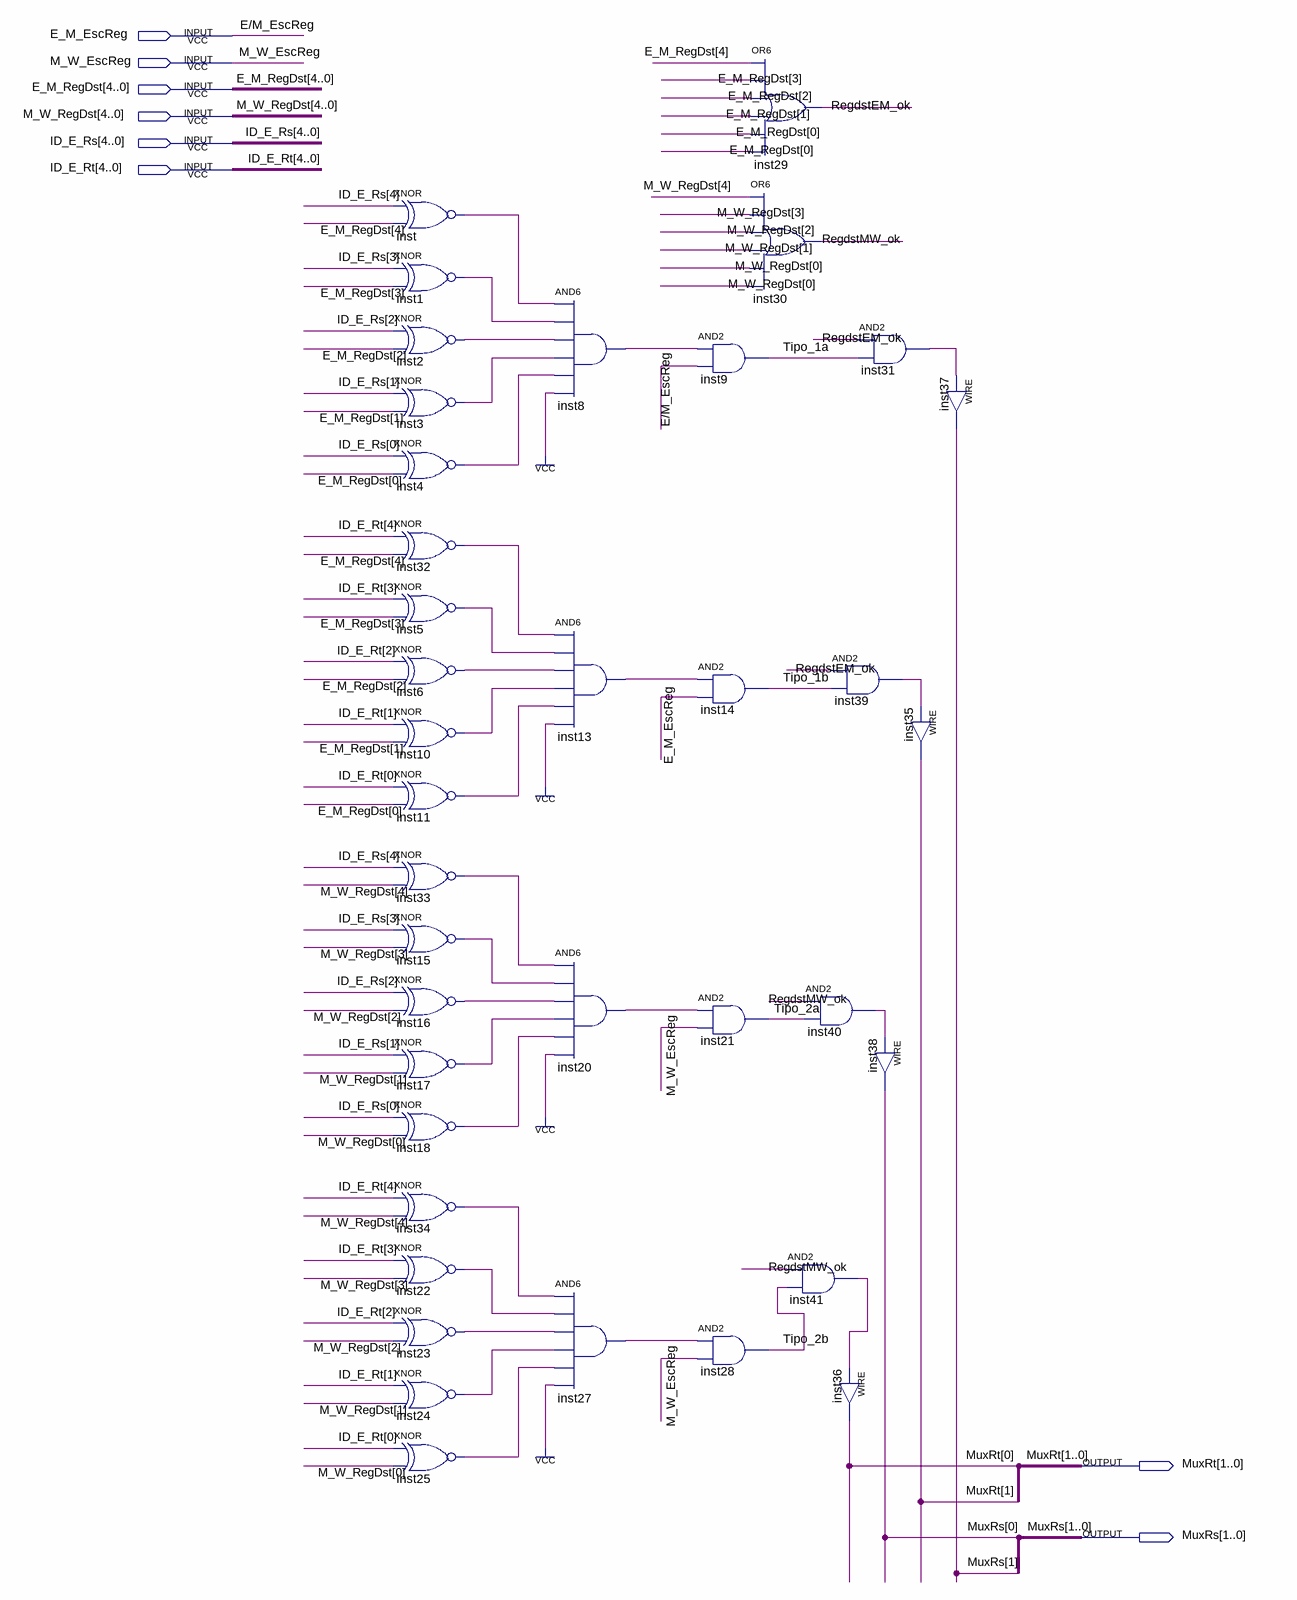
[diagram p0: schematic sheet]
// Quartus schematic Unidade_Forwarding.bdf as structural Verilog: 38 symbols, 8 pins
module Unidade_Forwarding (
  input  E_M_EscReg,
  input  M_W_EscReg,
  input  [4:0] E_M_RegDst,
  input  [4:0] M_W_RegDst,
  input  [4:0] ID_E_Rs,
  input  [4:0] ID_E_Rt,
  output [1:0] MuxRt,
  output [1:0] MuxRs
);

  wire inst1_out, inst2_out, inst3_out, inst4_out, inst5_out, inst6_out, inst8_out, inst10_out, inst11_out,
       inst13_out, inst15_out, inst16_out, inst17_out, inst18_out, inst20_out, inst22_out, inst23_out,
       inst24_out, inst25_out, inst27_out, inst31_out, inst32_out, inst33_out, inst34_out, inst39_out,
       inst40_out, inst41_out, inst_out, RegdstEM_ok, RegdstMW_ok, Tipo_1a, Tipo_1b, Tipo_2a, Tipo_2b;

  xnor inst (inst_out, ID_E_Rs[4], E_M_RegDst[4]);
  xnor inst1 (inst1_out, ID_E_Rs[3], E_M_RegDst[3]);
  xnor inst2 (inst2_out, ID_E_Rs[2], E_M_RegDst[2]);
  xnor inst3 (inst3_out, ID_E_Rs[1], E_M_RegDst[1]);
  xnor inst4 (inst4_out, ID_E_Rs[0], E_M_RegDst[0]);
  xnor inst32 (inst32_out, ID_E_Rt[4], E_M_RegDst[4]);
  xnor inst5 (inst5_out, ID_E_Rt[3], E_M_RegDst[3]);
  xnor inst6 (inst6_out, ID_E_Rt[2], E_M_RegDst[2]);
  xnor inst10 (inst10_out, ID_E_Rt[1], E_M_RegDst[1]);
  xnor inst11 (inst11_out, ID_E_Rt[0], E_M_RegDst[0]);
  xnor inst33 (inst33_out, ID_E_Rs[4], M_W_RegDst[4]);
  xnor inst15 (inst15_out, ID_E_Rs[3], M_W_RegDst[3]);
  xnor inst16 (inst16_out, ID_E_Rs[2], M_W_RegDst[2]);
  xnor inst17 (inst17_out, ID_E_Rs[1], M_W_RegDst[1]);
  xnor inst18 (inst18_out, ID_E_Rs[0], M_W_RegDst[0]);
  xnor inst34 (inst34_out, ID_E_Rt[4], M_W_RegDst[4]);
  xnor inst22 (inst22_out, ID_E_Rt[3], M_W_RegDst[3]);
  xnor inst23 (inst23_out, ID_E_Rt[2], M_W_RegDst[2]);
  xnor inst24 (inst24_out, ID_E_Rt[1], M_W_RegDst[1]);
  xnor inst25 (inst25_out, ID_E_Rt[0], M_W_RegDst[0]);
  and inst8 (inst8_out, inst_out, inst1_out, inst2_out, inst3_out, inst4_out, 1'b1);
  and inst13 (inst13_out, inst32_out, inst5_out, inst6_out, inst10_out, inst11_out, 1'b1);
  and inst20 (inst20_out, inst33_out, inst15_out, inst16_out, inst17_out, inst18_out, 1'b1);
  and inst27 (inst27_out, inst34_out, inst22_out, inst23_out, inst24_out, inst25_out, 1'b1);
  and inst9 (Tipo_1a, inst8_out, E_M_EscReg);
  and inst14 (Tipo_1b, inst13_out, E_M_EscReg);
  and inst21 (Tipo_2a, inst20_out, M_W_EscReg);
  and inst28 (Tipo_2b, inst27_out, M_W_EscReg);
  or inst29 (RegdstEM_ok, E_M_RegDst[4], E_M_RegDst[3], E_M_RegDst[2], E_M_RegDst[1], E_M_RegDst[0], E_M_RegDst[0]);
  or inst30 (RegdstMW_ok, M_W_RegDst[4], M_W_RegDst[3], M_W_RegDst[2], M_W_RegDst[1], M_W_RegDst[0], M_W_RegDst[0]);
  and inst39 (inst39_out, RegdstEM_ok, Tipo_1b);
  and inst40 (inst40_out, RegdstMW_ok, Tipo_2a);
  and inst41 (inst41_out, RegdstMW_ok, Tipo_2b);
  assign MuxRt[0] = inst41_out;  // WIRE inst36
  and inst31 (inst31_out, RegdstEM_ok, Tipo_1a);
  assign MuxRt[1] = inst39_out;  // WIRE inst35
  assign MuxRs[0] = inst40_out;  // WIRE inst38
  assign MuxRs[1] = inst31_out;  // WIRE inst37

  // Other names for the same wires on the sheet: E/M_EscReg = E_M_EscReg
endmodule
